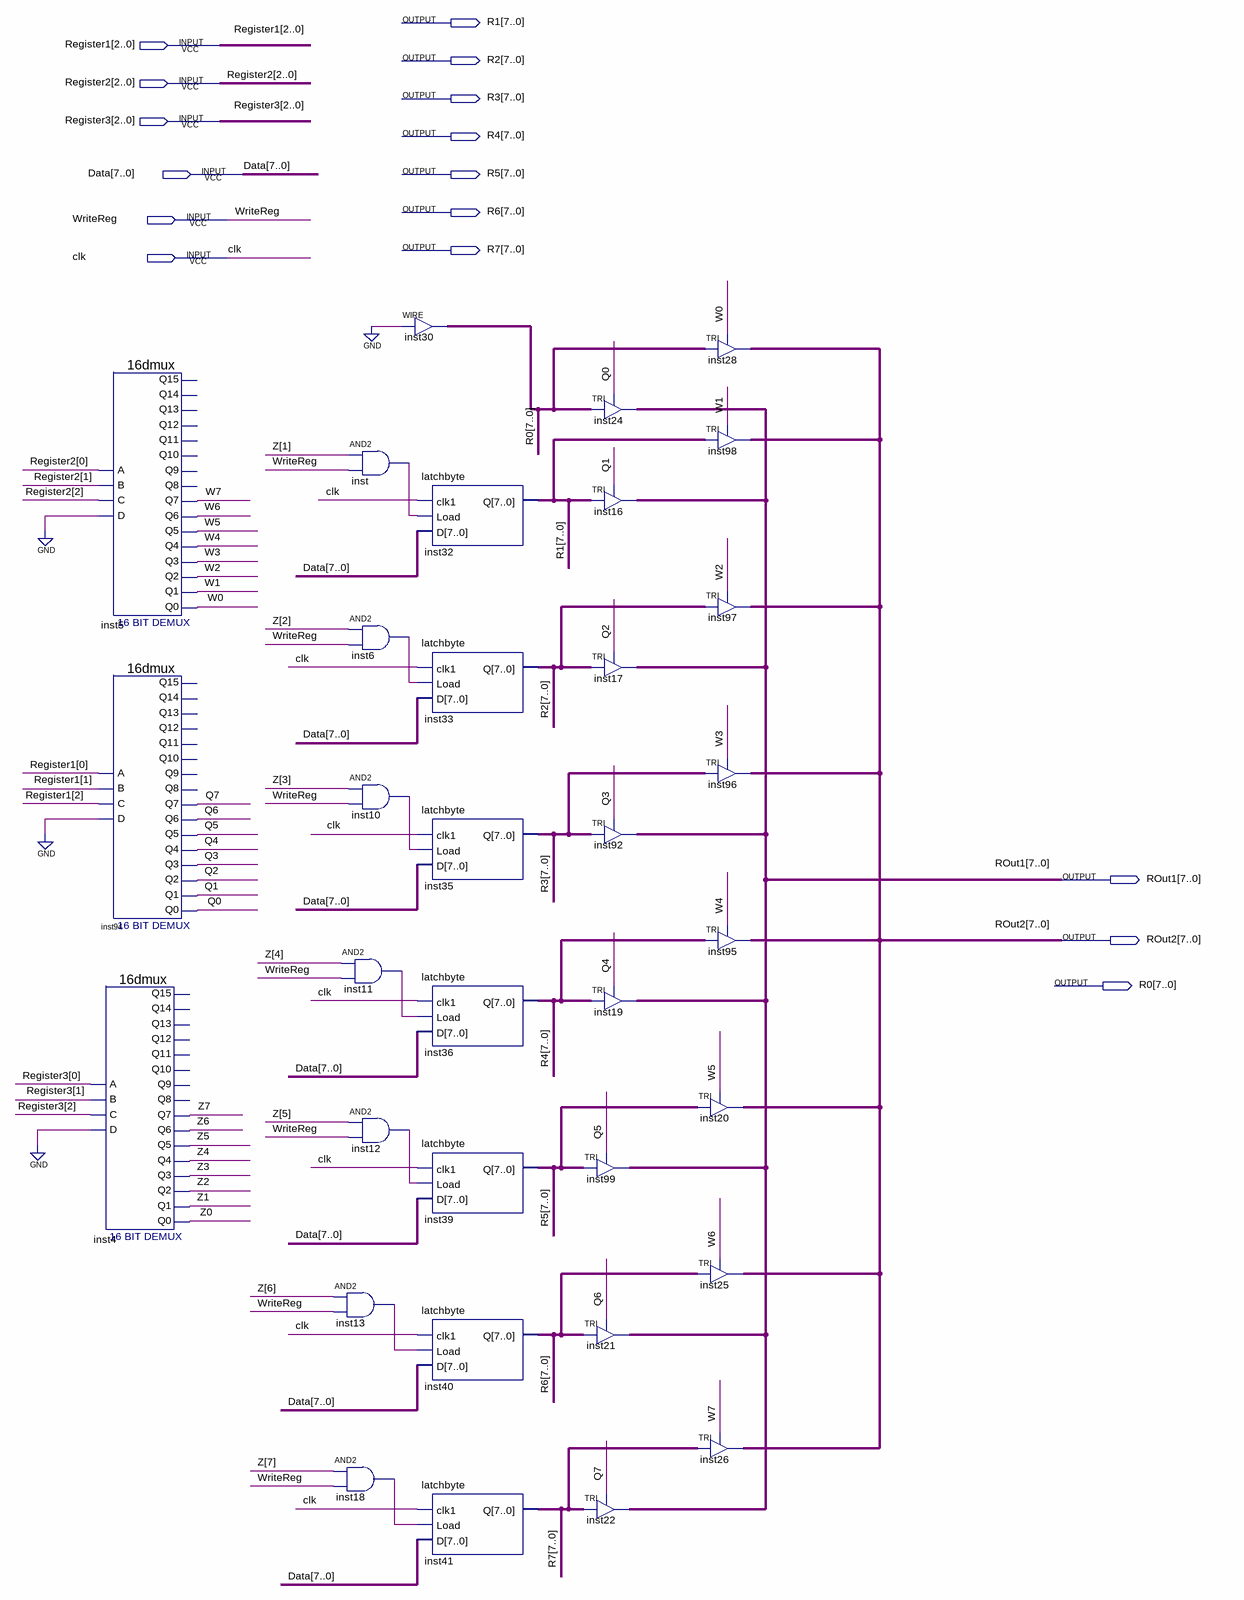
[diagram p0: schematic sheet]
// Quartus schematic Register_File.bdf as structural Verilog: 34 symbols, 16 pins
module Register_File (
  input  [2:0] Register1,
  input  [2:0] Register2,
  input  [2:0] Register3,
  input  [7:0] Data,
  input  WriteReg,
  input  clk,
  output [7:0] R1,
  output [7:0] R2,
  output [7:0] R3,
  output [7:0] R4,
  output [7:0] R5,
  output [7:0] R6,
  output [7:0] R7,
  output [7:0] ROut1,
  output [7:0] ROut2,
  output [7:0] R0
);

  wire inst6_out, inst10_out, inst11_out, inst12_out, inst13_out, inst18_out, inst_out, Q0, Q1, Q2, Q3, Q4,
       Q5, Q6, Q7, W0, W1, W2, W3, W4, W5, W6, W7, Z0;
  wire [7:1] Z;

  \16dmux  inst5 (
    .C(Register2[2]), .B(Register2[1]), .A(Register2[0]), .D(1'b0), .Q7(W7), .Q4(W4), .Q5(W5), .Q6(W6),
    .Q2(W2), .Q3(W3), .Q0(W0), .Q1(W1));  // open: Q12, Q13, Q11, Q9, Q10, Q8, Q14, Q15
  \16dmux  inst94 (
    .C(Register1[2]), .B(Register1[1]), .A(Register1[0]), .D(1'b0), .Q7(Q7), .Q4(Q4), .Q5(Q5), .Q6(Q6),
    .Q2(Q2), .Q3(Q3), .Q0(Q0), .Q1(Q1));  // open: Q12, Q13, Q11, Q9, Q10, Q8, Q14, Q15
  \16dmux  inst4 (
    .C(Register3[2]), .B(Register3[1]), .A(Register3[0]), .D(1'b0), .Q7(Z[7]), .Q4(Z[4]), .Q5(Z[5]),
    .Q6(Z[6]), .Q2(Z[2]), .Q3(Z[3]), .Q0(Z0), .Q1(Z[1]));  // open: Q12, Q13, Q11, Q9, Q10, Q8, Q14, Q15
  and inst (inst_out, Z[1], WriteReg);
  and inst6 (inst6_out, Z[2], WriteReg);
  and inst10 (inst10_out, Z[3], WriteReg);
  and inst11 (inst11_out, Z[4], WriteReg);
  and inst12 (inst12_out, Z[5], WriteReg);
  and inst13 (inst13_out, Z[6], WriteReg);
  and inst18 (inst18_out, Z[7], WriteReg);
  assign R0 = {8{1'b0}};  // WIRE inst30
  latchbyte inst32 (.clk1(clk), .Load(inst_out), .D(Data), .Q(R1));
  latchbyte inst33 (.clk1(clk), .Load(inst6_out), .D(Data), .Q(R2));
  latchbyte inst35 (.clk1(clk), .Load(inst10_out), .D(Data), .Q(R3));
  latchbyte inst36 (.clk1(clk), .Load(inst11_out), .D(Data), .Q(R4));
  latchbyte inst39 (.clk1(clk), .Load(inst12_out), .D(Data), .Q(R5));
  latchbyte inst40 (.clk1(clk), .Load(inst13_out), .D(Data), .Q(R6));
  latchbyte inst41 (.clk1(clk), .Load(inst18_out), .D(Data), .Q(R7));
  TRI inst24[7:0] (.IN(R0), .OE(Q0), .OUT(ROut1));
  TRI inst16[7:0] (.IN(R1), .OE(Q1), .OUT(ROut1));
  TRI inst17[7:0] (.IN(R2), .OE(Q2), .OUT(ROut1));
  TRI inst92[7:0] (.IN(R3), .OE(Q3), .OUT(ROut1));
  TRI inst19[7:0] (.IN(R4), .OE(Q4), .OUT(ROut1));
  TRI inst99[7:0] (.IN(R5), .OE(Q5), .OUT(ROut1));
  TRI inst21[7:0] (.IN(R6), .OE(Q6), .OUT(ROut1));
  TRI inst22[7:0] (.IN(R7), .OE(Q7), .OUT(ROut1));
  TRI inst28[7:0] (.IN(R0), .OE(W0), .OUT(ROut2));
  TRI inst98[7:0] (.IN(R1), .OE(W1), .OUT(ROut2));
  TRI inst97[7:0] (.IN(R2), .OE(W2), .OUT(ROut2));
  TRI inst96[7:0] (.IN(R3), .OE(W3), .OUT(ROut2));
  TRI inst95[7:0] (.IN(R4), .OE(W4), .OUT(ROut2));
  TRI inst20[7:0] (.IN(R5), .OE(W5), .OUT(ROut2));
  TRI inst25[7:0] (.IN(R6), .OE(W6), .OUT(ROut2));
  TRI inst26[7:0] (.IN(R7), .OE(W7), .OUT(ROut2));
endmodule
